# EAGLE schematic mainboard (EAGLE 6.5.0)
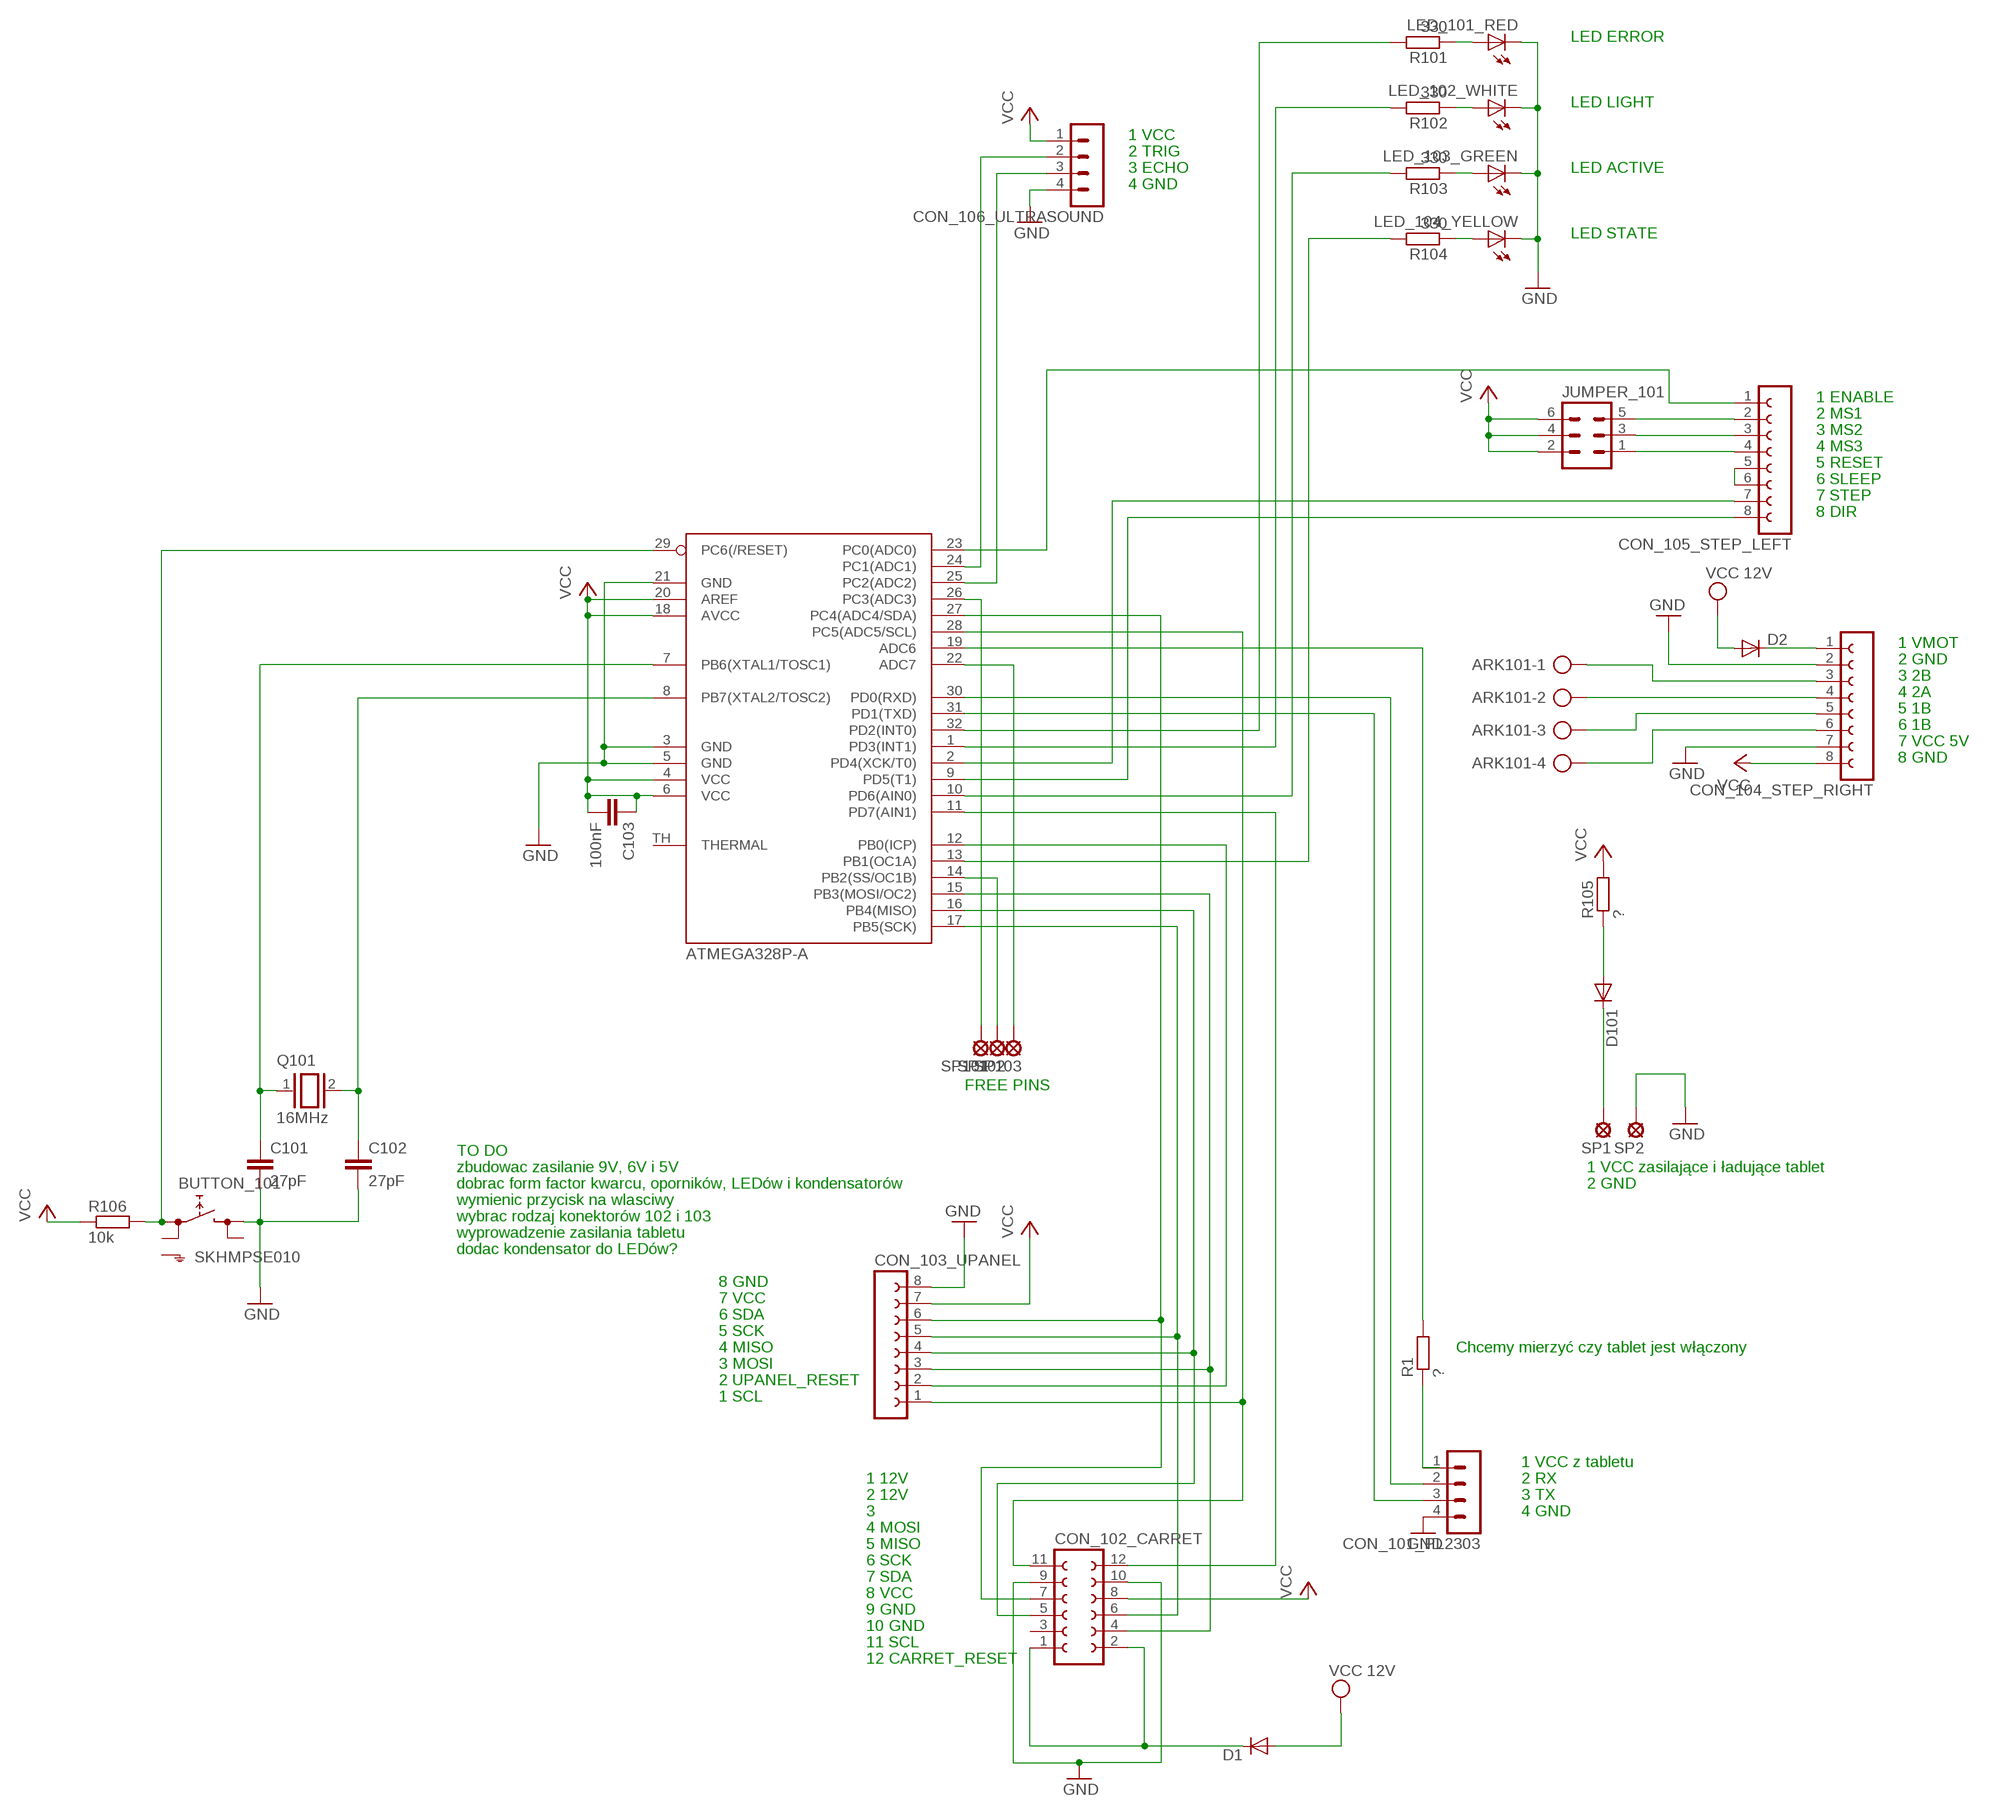
[diagram p0: schematic, sheet 1]

## Parts
ARK101  AK300/4  [AK300/4]
ATMEGA328P-A  MEGA8-MI  [MLF32-TH]
BUTTON_101  SKHMPSE010  [SKHMPXE010]
C101  27pF  C5/5  [C5B5]
C102  27pF  C5/5  [C5B5]
C103  100nF  C5/5  [C5B5]
CON_101_PL2303  MA04-1  [MA04-1]
CON_102_CARRET  FE06-2  [FE06-2]
CON_103_UPANEL  FE08-1  [FE08]
CON_104_STEP_RIGHT  FE08-1  [FE08]
CON_105_STEP_LEFT  FE08-1  [FE08]
CON_106_ULTRASOUND  MA04-1  [MA04-1]
D1  1N5060GP  [DO15-12]
D2  1N5060GP  [DO15-12]
D101  1N5060GP  [DO15-12]
JUMPER_101  MA03-2  [MA03-2]
LED_101_RED  LEDCHIPLED_1206  [CHIPLED_1206]
LED_102_WHITE  LEDCHIPLED_1206  [CHIPLED_1206]
LED_103_GREEN  LEDCHIPLED_1206  [CHIPLED_1206]
LED_104_YELLOW  LEDCHIPLED_1206  [CHIPLED_1206]
Q101  16MHz  XTAL/S  [QS]
R1  ?  R-EU_0613/15  [P0613/15]
R101  330  R-EU_M0805  [M0805]
R102  330  R-EU_M0805  [M0805]
R103  330  R-EU_M0805  [M0805]
R104  330  R-EU_M0805  [M0805]
R105  ?  R-EU_0613/15  [P0613/15]
R106  10k  R-EU_M3516  [M3516]
SP1  LSP11  [LSP11]
SP2  LSP11  [LSP11]
SP101  LSP11  [LSP11]
SP102  LSP11  [LSP11]
SP103  LSP11  [LSP11]

## Nets
GND: ATMEGA328P-A.3(GND) ATMEGA328P-A.5(GND) ATMEGA328P-A.21(GND) BUTTON_101.3(2.1) C101.2 C102.2 CON_101_PL2303.4 CON_102_CARRET.9 CON_102_CARRET.10 CON_103_UPANEL.8 CON_104_STEP_RIGHT.2 CON_104_STEP_RIGHT.7 CON_106_ULTRASOUND.4 LED_101_RED.C LED_102_WHITE.C LED_103_GREEN.C LED_104_YELLOW.C SP2.MP
JUMPER101: ATMEGA328P-A.23(PC0(ADC0)) CON_105_STEP_LEFT.1
N$1: ATMEGA328P-A.28(PC5(ADC5/SCL)) CON_102_CARRET.11 CON_103_UPANEL.1
N$2: ATMEGA328P-A.24(PC1(ADC1)) CON_106_ULTRASOUND.2
N$3: ATMEGA328P-A.12(PB0(ICP)) CON_103_UPANEL.2
N$4: ATMEGA328P-A.30(PD0(RXD)) CON_101_PL2303.2
N$5: ATMEGA328P-A.31(PD1(TXD)) CON_101_PL2303.3
N$6: D101.C SP1.MP
N$7: D101.A R105.1
N$8: ATMEGA328P-A.1(PD3(INT1)) R102.2
N$9: ATMEGA328P-A.10(PD6(AIN0)) R103.2
N$10: ATMEGA328P-A.13(PB1(OC1A)) R104.2
N$11: ATMEGA328P-A.32(PD2(INT0)) R101.2
N$12: LED_101_RED.A R101.1
N$13: LED_102_WHITE.A R102.1
N$14: ATMEGA328P-A.25(PC2(ADC2)) CON_106_ULTRASOUND.3
N$15: LED_104_YELLOW.A R104.1
N$16: ATMEGA328P-A.26(PC3(ADC3)) SP101.MP
N$17: ARK101.1 CON_104_STEP_RIGHT.3
N$18: ARK101.2 CON_104_STEP_RIGHT.4
N$19: ARK101.3 CON_104_STEP_RIGHT.5
N$20: ARK101.4 CON_104_STEP_RIGHT.6
N$21: R1.1
N$22: CON_104_STEP_RIGHT.1 D2.C
N$23: CON_102_CARRET.1 CON_102_CARRET.2 D1.C
N$24: CON_105_STEP_LEFT.5 CON_105_STEP_LEFT.6
N$25: ATMEGA328P-A.2(PD4(XCK/T0)) CON_105_STEP_LEFT.7
N$26: ATMEGA328P-A.9(PD5(T1)) CON_105_STEP_LEFT.8
N$27: ATMEGA328P-A.8(PB7(XTAL2/TOSC2)) C102.1 Q101.2
N$28: ATMEGA328P-A.29(PC6(/RESET)) BUTTON_101.1(1.1) R106.2
N$30: ATMEGA328P-A.15(PB3(MOSI/OC2)) CON_102_CARRET.4 CON_103_UPANEL.3
N$31: ATMEGA328P-A.16(PB4(MISO)) CON_102_CARRET.5 CON_103_UPANEL.4
N$32: ATMEGA328P-A.17(PB5(SCK)) CON_102_CARRET.6 CON_103_UPANEL.5
N$33: ATMEGA328P-A.27(PC4(ADC4/SDA)) CON_102_CARRET.7 CON_103_UPANEL.6
N$34: ATMEGA328P-A.11(PD7(AIN1)) CON_102_CARRET.12
N$35: CON_105_STEP_LEFT.2 JUMPER_101.5
N$36: ATMEGA328P-A.19(ADC6) R1.2
N$37: ATMEGA328P-A.22(ADC7) SP103.MP
N$38: ATMEGA328P-A.14(PB2(SS/OC1B)) SP102.MP
N$39: CON_105_STEP_LEFT.3 JUMPER_101.3
N$40: CON_105_STEP_LEFT.4 JUMPER_101.1
Q101: ATMEGA328P-A.7(PB6(XTAL1/TOSC1)) C101.1 Q101.1
R103: LED_103_GREEN.A R103.1
VCC: ATMEGA328P-A.4(VCC) ATMEGA328P-A.6(VCC) ATMEGA328P-A.18(AVCC) ATMEGA328P-A.20(AREF) C103.1 C103.2 CON_102_CARRET.8 CON_103_UPANEL.7 CON_104_STEP_RIGHT.8 CON_106_ULTRASOUND.1 D1.A D2.A JUMPER_101.2 JUMPER_101.4 JUMPER_101.6 R105.2 R106.1 ; supply symbol labelled VCC 12V
Unconnected: ATMEGA328P-A.TH(THERMAL) BUTTON_101.2(1.2) BUTTON_101.4(2.2) BUTTON_101.5(SH) CON_101_PL2303.1 CON_102_CARRET.3

## Notes on the sheet
- LED ERROR
- LED LIGHT
- 1 VCC
- 2 TRIG
- 3 ECHO | LED ACTIVE
- 4 GND
- LED STATE
- 1 ENABLE
- 2 MS1
- 3 MS2
- 4 MS3
- 5 RESET
- 6 SLEEP
- 7 STEP
- 8 DIR
- 1 VMOT
- 2 GND
- 3 2B
- 4 2A
- 5 1B
- 6 1B
- 7 VCC 5V
- 8 GND
- FREE PINS
- TO DO
- zbudowac zasilanie 9V, 6V i 5V | 1 VCC zasilające i ładujące tablet
- dobrac form factor kwarcu, oporników, LEDów i kondensatorów | 2 GND
- wymienic przycisk na wlasciwy
- wybrac rodzaj konektorów 102 i 103
- wyprowadzenie zasilania tabletu
- dodac kondensator do LEDów?
- 8 GND
- 7 VCC
- 6 SDA
- 5 SCK
- 4 MISO | Chcemy mierzyć czy tablet jest włączony
- 3 MOSI
- 2 UPANEL_RESET
- 1 SCL
- 1 VCC z tabletu
- 1 12V | 2 RX
- 2 12V | 3 TX
- 3 | 4 GND
- 4 MOSI
- 5 MISO
- 6 SCK
- 7 SDA
- 8 VCC
- 9 GND
- 10 GND
- 11 SCL
- 12 CARRET_RESET

## Library data of the parts
ARK101 = con-ptr500:AK300/4: CONNECTOR
ATMEGA328P-A = atmel:MEGA8-MI: MICROCONTROLLER 8 Kbytes FLASH, 1 kbytes SRAM, 512 bytes EEPROM, USART, 6-channel 10 bit ADC, 2-channel 8 bit ADC Pin compatible with Atmega48, ATMega88, ATMega168 Source: avr.lbr
BUTTON_101 = switch:SKHMP*E010: 6.2 X 6.5mm TACT Switch (SMD) Source: http://www3.alps.co.jp/WebObjects/catalog.woa/PDF/E/Switch/Tact/SKHM/SKHM.PDF
C101-C103 = capacitor-wima:C: CAPACITOR naming: grid - package width
CON_101_PL2303 CON_106_ULTRASOUND = con-lstb:MA04-1: PIN HEADER
CON_102_CARRET = con-lsta:FE06-2: FEMALE HEADER
CON_103_UPANEL CON_104_STEP_RIGHT CON_105_STEP_LEFT = con-lsta:FE08-1: FEMALE HEADER
D1 D2 D101 = diode:1N5060GP: DIODE controlled avalanche rectifier
JUMPER_101 = con-lstb:MA03-2: PIN HEADER
LED_101_RED LED_102_WHITE LED_103_GREEN LED_104_YELLOW = led:LED: LED OSRAM: - CHIPLED LG R971, LG N971, LY N971, LG Q971, LY Q971, LO R971, LY R971 LH N974, LH R974 LS Q976, LO Q976, LY Q976 LO Q996 - Hyper CHIPLED LW Q18S LB Q993, LB Q99A, LB R99A - SideLED LS A670, LO A670, LY A670, LG A670, LP A670 LB A673, LV A673, LT A673, LW A673 LH A674 LY A675 LS A676, LA A676, LO A676, LY A676, LW A676 LS A679, LY A679, LG A679 - Hyper Micro SIDELED® LS Y876, LA Y876, LO Y876, LY Y876 LT Y87S - SmartLED LW L88C, LW L88S LB L89C, LB L89S, LG L890 LS L89K, LO L89K, LY L89K LS L896, LA L896, LO L896, LY L896 - TOPLED LS T670, LO T670, LY T670, LG T670, LP T670 LSG T670, LSP T670, LSY T670, LOP T670, LYG T670 LG T671, LOG T671, LSG T671 LB T673, LV T673, LT T673, LW T673 LH T674 LS T676, LA T676, LO T676, LY T676, LB T676, LH T676, LSB T676, LW T676 LB T67C, LV T67C, LT T67C, LS T67K, LO T67K, LY T67K, LW E67C LS E67B, LA E67B, LO E67B, LY E67B, LB E67C, LV E67C, LT E67C LW T67C LS T679, LY T679, LG T679 LS T770, LO T770, LY T770, LG T770, LP T770 LB T773, LV T773, LT T773, LW T773 LH T774 LS E675, LA E675, LY E675, LS T675 LS T776, LA T776, LO T776, LY T776, LB T776 LHGB T686 LT T68C, LB T68C - Hyper Mini TOPLED® LB M676 - Mini TOPLED Santana® LG M470 LS M47K, LO M47K, LY M47K Source: http://www.osram.convergy.de LUXEON: - LUMILED® LXK2-PW12-R00, LXK2-PW12-S00, LXK2-PW14-U00, LXK2-PW14-V00 LXK2-PM12-R00, LXK2-PM12-S00, LXK2-PM14-U00 LXK2-PE12-Q00, LXK2-PE12-R00, LXK2-PE12-S00, LXK2-PE14-T00, LXK2-PE14-U00 LXK2-PB12-K00, LXK2-PB12-L00, LXK2-PB12-M00, LXK2-PB14-N00, LXK2-PB14-P00, LXK2-PB14-Q00 LXK2-PR12-L00, LXK2-PR12-M00, LXK2-PR14-Q00, LXK2-PR14-R00 LXK2-PD12-Q00, LXK2-PD12-R00, LXK2-PD12-S00 LXK2-PH12-R00, LXK2-PH12-S00 LXK2-PL12-P00, LXK2-PL12-Q00, LXK2-PL12-R00 Source: www.luxeon.com KINGBRIGHT: KA-3528ASYC Source: www.kingbright.com
Q101 = special:XTAL/S: CRYSTAL
R1 R101-R106 = resistor:R-EU_: RESISTOR, European symbol
SP1 SP2 SP101-SP103 = solpad:LSP11: SOLDER PAD drill 1.1 mm